# Altium schematic sheet Alimentation.SchDoc
size A
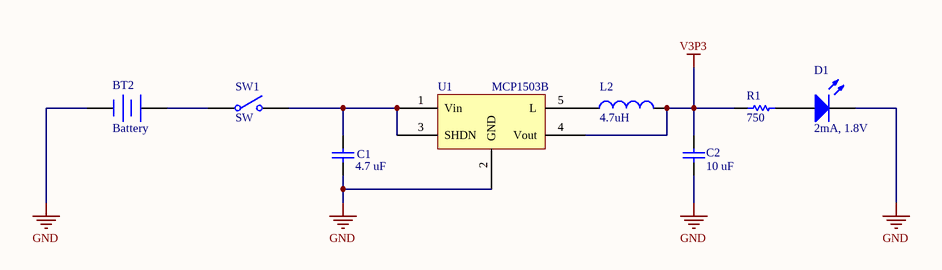
[diagram p0: Alimentation.SchDoc]

## Parts
BT2  Battery  [Battery Holder]
C1  4.7 uF  [CAP 0603]
C2  10 uF  [CAP 0603]
D1  2mA, 1.8V  [LED]
L2  4.7uH  [Coil]
R1  750  [RES 0603]
SW1  SW  [SWITCH ON/OFF]
U1  MCP1503B  [MCP1603B/TSOT]

## Nets
GND: BT2.2(-) C1.1 C2.1 D1.2(K) U1.2(GND)
V3P3: C2.2 L2.2 R1.2 U1.4(Vout)
NetBT2_1: BT2.1(+) SW1.1(COMMON)
NetC1_2: C1.2 SW1.2(NO) U1.1(Vin) U1.3(SHDN)
NetD1_1: D1.1(A) R1.1
NetL2_1: L2.1 U1.5(L)

## Library data of the parts
BT2 = Battery: Multicell Battery; Fabricant: Keystone; Fournisseur: Farnell; RefFabricant: 1017; RefFournisseur: 1888395; PackageReference: BAT-2; PackageDescription: Battery; 2 Leads
C1 C2 = Cap: Capacitor; Value: 4.7uF; PackageReference: RAD-0.3; PackageDescription: Radial Cap, Thru-Hole; 2 Leads; 0.3 in Pin Spacing
D1 = LED0: Typical INFRARED GaAs LED; Fabricant: Kingbright; Fournisseur: Farnell; RefFabricant: KPT-2012LVSECK-J3-PRV; RefFournisseur: 2610416; PackageReference: LED-0; PackageDescription: LED; 2 Leads; Value: 2mA, 1.8V
L2 = Inductor: Code_IEC: 1005; Fabricant: Coilcraft; Fournisseur: Farnell; RefFabricant: XFL3012-472MEB; RefFournisseur: 2289189; PackageReference: 0402-A; PackageDescription: Chip Inductor; Code_JEITA: 0402; Value: 4.7uH
R1 = Res1: Resistor; PackageReference: AXIAL-0.3; PackageDescription: Axial Device, Thru-Hole; 2 Leads; 0.3 in Pin Spacing; Value: 750
SW1 = SW-SPST: Single-Pole, Single-Throw Switch; Fabricant: ERG COMPONENTS; Fournisseur: Farnell; RefFabricant: SDS-1-017; RefFournisseur: 1203424; PackageReference: SPST-2; PackageDescription: Switch; 2 Leads
U1 = MCP1603B: Fixed 3.3Vout 0.5Aout regulator; Fabricant: Microchip; RefFabricant: MCP1603T-330I/OS; Fournisseur: Farnell; RefFournisseur: 1439373; PackageDescription: Regulator